# Altium schematic sheet CYAN_EVSE_Power_board_v1.0.SchDoc
size A4
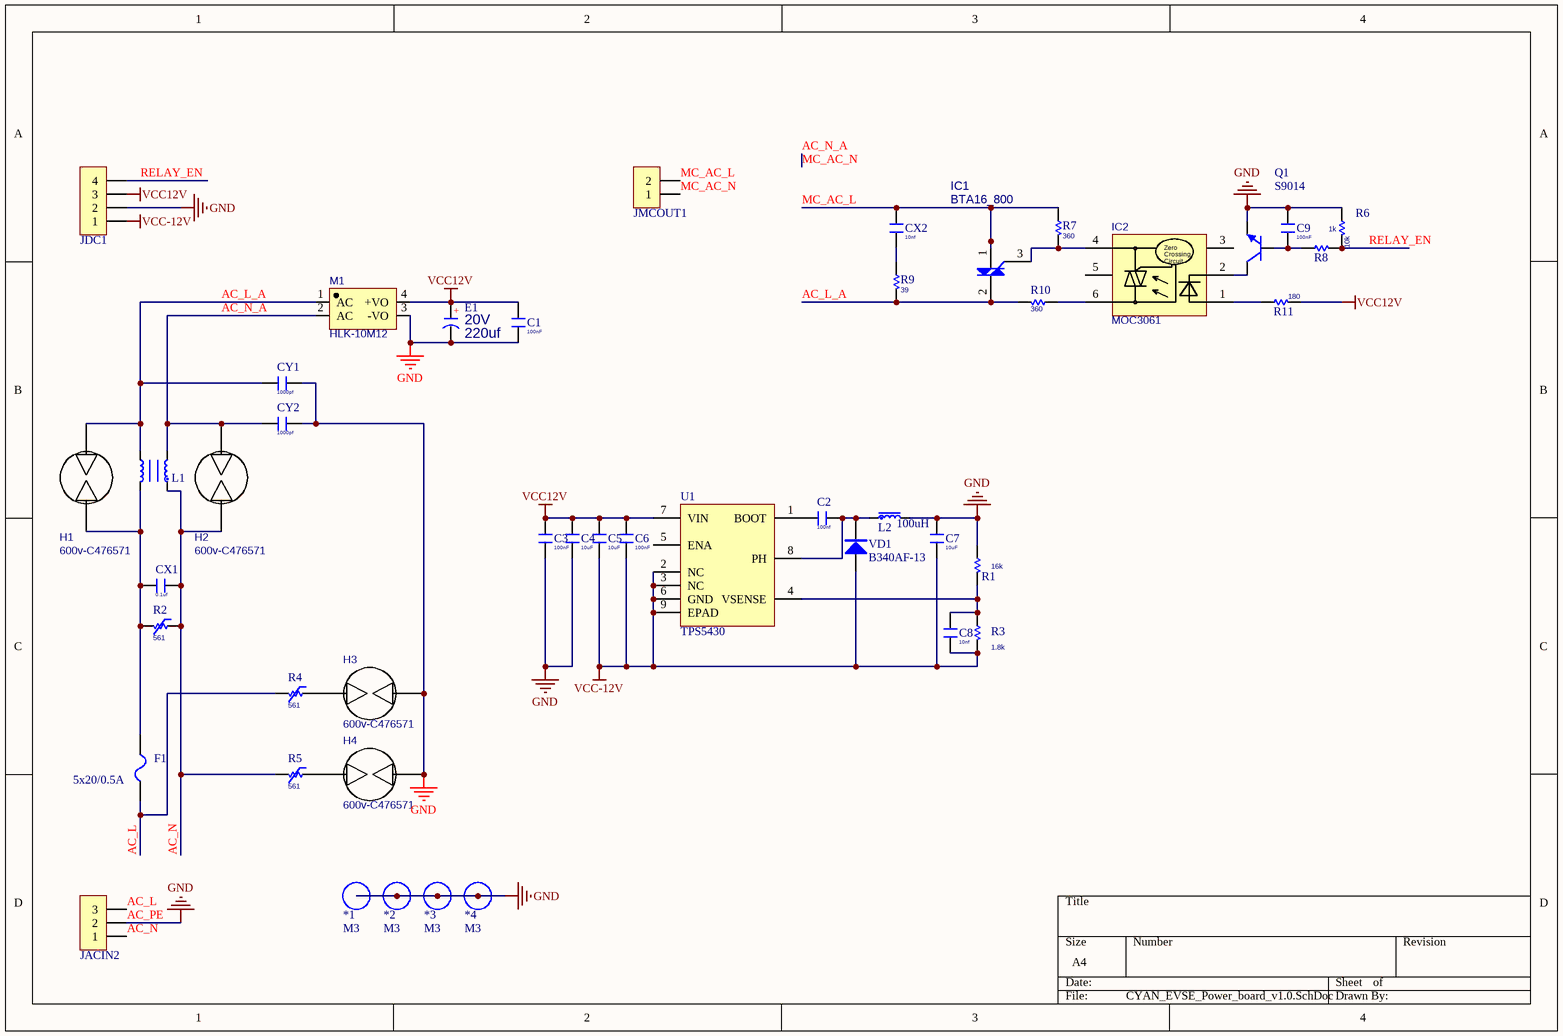
[diagram p0: CYAN_EVSE_Power_board_v1.0.SchDoc]

## Parts
*1  M3  [M3 125X300]
*2  M3  [M3 125X300]
*3  M3  [M3 125X300]
*4  M3  [M3 125X300]
C1  value 100nF  [C 0805]  (hidden comment: C)
C2  value 100nf  [C 0805]  (hidden comment: C)
C3  value 100nF  [C 0805]  (hidden comment: C)
C4  value 10uF  [C 0805]  (hidden comment: C)
C5  value 10uF  [C 0805]  (hidden comment: C)
C6  value 100nF  [C 0805]  (hidden comment: C)
C7  value 10uF  [C 0805]  (hidden comment: C)
C8  value 10nf  [C 0805]  (hidden comment: C)
C9  value 100nF  [C 0805]  (hidden comment: C)
CX1  value 0.1uf  [CX 10*13*11]  (hidden comment: MKP-0.1uF275V)
CX2  value 10nf  [CX 10*13*11]  (hidden comment: X1 安规电容)
CY1  value 1000pf  [CY 7.5*8*4]  (hidden comment: DCF102M26Y5VQ6B)
CY2  value 1000pf  [CY 7.5*8*4]  (hidden comment: DCF102M26Y5VQ6B)
E1  value 220uf  Voltage: 20V  [CM D(6.3*5.4)]  (hidden comment: C-CM)
F1  5x20/0.5A  [FU BLX-A]
H1  600v-C476571  [GDT_SMD_L4.5-W3.2]
H2  600v-C476571  [GDT_SMD_L4.5-W3.2]
H3  600v-C476571  [GDT_SMD_L4.5-W3.2]
H4  600v-C476571  [GDT_SMD_L4.5-W3.2]
IC1  BTA16_800  [TO220A]
IC2  MOC3061  [DIP6-300]
JACIN2  HDR-1X3  [KF2EDGK5.0-3P_H]  (value not drawn)
JDC1  HDR-1X4  [MC 1,5/ 4-G-3,81]  (value not drawn)
JMCOUT1  HDR-1X2  [MC 1,5/ 2-G-3,81]  (value not drawn)
L1  15mH  [UU9.8]  (value not drawn)
L2  100uH  [CD75]
M1  HLK-10M12  [PWRM-TH_HLK-10MXX]
Q1  S9014  [SOT23-3N]
R1  value 16k  [R 0805]  (hidden comment: R)
R2  value 561  [VDR 10D-7.5]  (hidden comment: 10d561k)
R3  value 1.8k  [R 0805]  (hidden comment: R)
R4  value 561  [VDR 10D-7.5]  (hidden comment: 10d561k)
R5  value 561  [VDR 10D-7.5]  (hidden comment: 10d561k)
R6  value 10k  [R 0805]  (hidden comment: R)
R7  value 360  [RS 1/2W]  (hidden comment: R-CRR)
R8  value 1k  [R 0805]  (hidden comment: R)
R9  value 39  [RS 2W]  (hidden comment: R-CRR)
R10  value 360  [RS 1/2W]  (hidden comment: R-CRR)
R11  value 180  [R 0805]  (hidden comment: R)
U1  TPS5430  [SOP8_EPAD_VIA]
VD1  B340AF-13  [SMA]

## Nets
AC_PE: *1.0 *2.0 *3.0 *4.0 C1.1 C3.1 C4.2 C7.2 C9.1 CY1.1 CY2.1 E1.2 H3.2 H4.2 JACIN2.2 JDC1.2 L2.2 M1.3(-VO) Q1.2(E) R1.1 R6.1  [also labelled GND]
VCC12V: C1.2 C3.2 C4.1 C5.2 C6.2 E1.1 JDC1.3 M1.4(+VO) R11.2 U1.7(VIN)
VCC-12V: C5.1 C6.1 C7.1 C8.2 JDC1.1 R3.2 U1.2(NC) U1.3(NC) U1.6(GND) U1.9(EPAD) VD1.1(A)
AC_L: F1.2 JACIN2.3 R4.2
AC_L_A: CY1.2 H1.2 IC1.2(A2) L1.3 M1.1(AC) R9.2 R10.2
AC_N: CX1.1 H2.1 JACIN2.1 L1.1 R2.1 R5.2
AC_N_A: CY2.2 H2.2 JMCOUT1.1 L1.2 M1.2(AC)  [also labelled MC_AC_N]
MC_AC_L: CX2.1 IC1.1(A1) JMCOUT1.2 R7.1
RELAY_EN: JDC1.4 R6.2 R8.2
NetC2_1: C2.1 U1.1(BOOT)
NetC2_2: C2.2 L2.1 U1.8(PH) VD1.2(K)
NetC8_1: C8.1 R1.2 R3.1 U1.4(VSENSE)
NetC9_2: C9.2 Q1.1(B) R8.1
NetCX1_2: CX1.2 F1.1 H1.1 L1.4 R2.2
NetCX2_2: CX2.2 R9.1
NetH3_1: H3.1 R4.1
NetH4_1: H4.1 R5.1
NetIC1_3: IC1.3(G) IC2.4(T2) R7.2
NetIC2_1: IC2.1(A) R11.1
NetIC2_2: IC2.2(K) Q1.3(C)
NetIC2_6: IC2.6(T1) R10.1

Not connected (* = marked no-connect by the designer): IC2 3(NC) 5(NC); U1 5(ENA)

## Notes on the sheet
- (in symbol C-CM) +
- (in symbol MOC304(6)1) Zero / Crossing / Circuit

## Library data of the parts
*1-*4 = M3: 铜柱孔
C1 C7 = C: 无极性贴片电容; Voltage: 25V
C2-C6 C8 = C: 无极性贴片电容; Voltage: 50V
C9 = C: 无极性贴片电容; Voltage: 20V
CX1 = C-CX: X电容; Voltage: 10v
CX2 = C-CX: X电容; Voltage: 440V
CY1 CY2 = C-CY: 高压陶瓷电容，Y电容; Voltage: 250v
E1 = C-CM: 贴片电解电容
F1 = FU 5x20: 5*20保险丝
H1-H4 = GDT: 气体放电管
IC1 = BTA12_600: 双向可控硅
IC2 = MOC304(6)1: 4(6)00v 带过0检测 光电可控硅 led电流15ma 1.3v; BOM_Manufacturer: FAIRCHILD; BOM_Manufacturer Part: MOC3041M; BOM_Supplier: LCSC; image: //image.lceda.cn/szlcsc/C8921.jpg; BOM_Supplier Part: C8921; spicePre: U; spiceSymbolName: MOC3041M
JACIN2 = Header 3: 3P接插件
JDC1 = Header 4: 4P接插件
JMCOUT1 = Header 2: 2P接插件
L1 = L-CMC: 共模电感
L2 = L-CD: 贴片功率电感
M1 = HLK-10MXX: HILINK 10W AC-DC 模块
Q1 = 9014-SMD: 低噪放大-NPN型
R1 R3 R6 R8 R11 = R: 贴片电阻
R2 R4 R5 = R_VDR: 压敏电阻
R7 R9 R10 = R-CRR: 直插色环电阻
U1 = TPS5430: 3A 36v buck控制器，内置fet
VD1 = SS14: 肖特基二极管